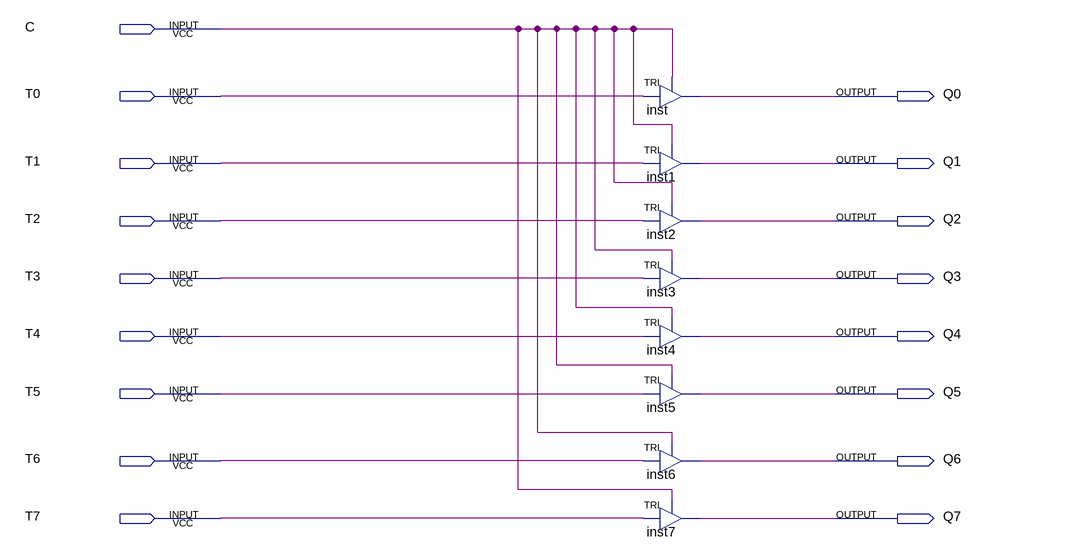
[diagram p0: schematic sheet]
// Quartus schematic Three_state.bdf as structural Verilog: 8 symbols, 17 pins
module Three_state (
  input  C,
  input  T0,
  input  T1,
  input  T2,
  input  T3,
  input  T4,
  input  T5,
  input  T6,
  input  T7,
  output Q0,
  output Q1,
  output Q2,
  output Q3,
  output Q4,
  output Q5,
  output Q6,
  output Q7
);

  TRI inst (.IN(T0), .OE(C), .OUT(Q0));
  TRI inst1 (.IN(T1), .OE(C), .OUT(Q1));
  TRI inst2 (.IN(T2), .OE(C), .OUT(Q2));
  TRI inst3 (.IN(T3), .OE(C), .OUT(Q3));
  TRI inst4 (.IN(T4), .OE(C), .OUT(Q4));
  TRI inst5 (.IN(T5), .OE(C), .OUT(Q5));
  TRI inst6 (.IN(T6), .OE(C), .OUT(Q6));
  TRI inst7 (.IN(T7), .OE(C), .OUT(Q7));
endmodule
